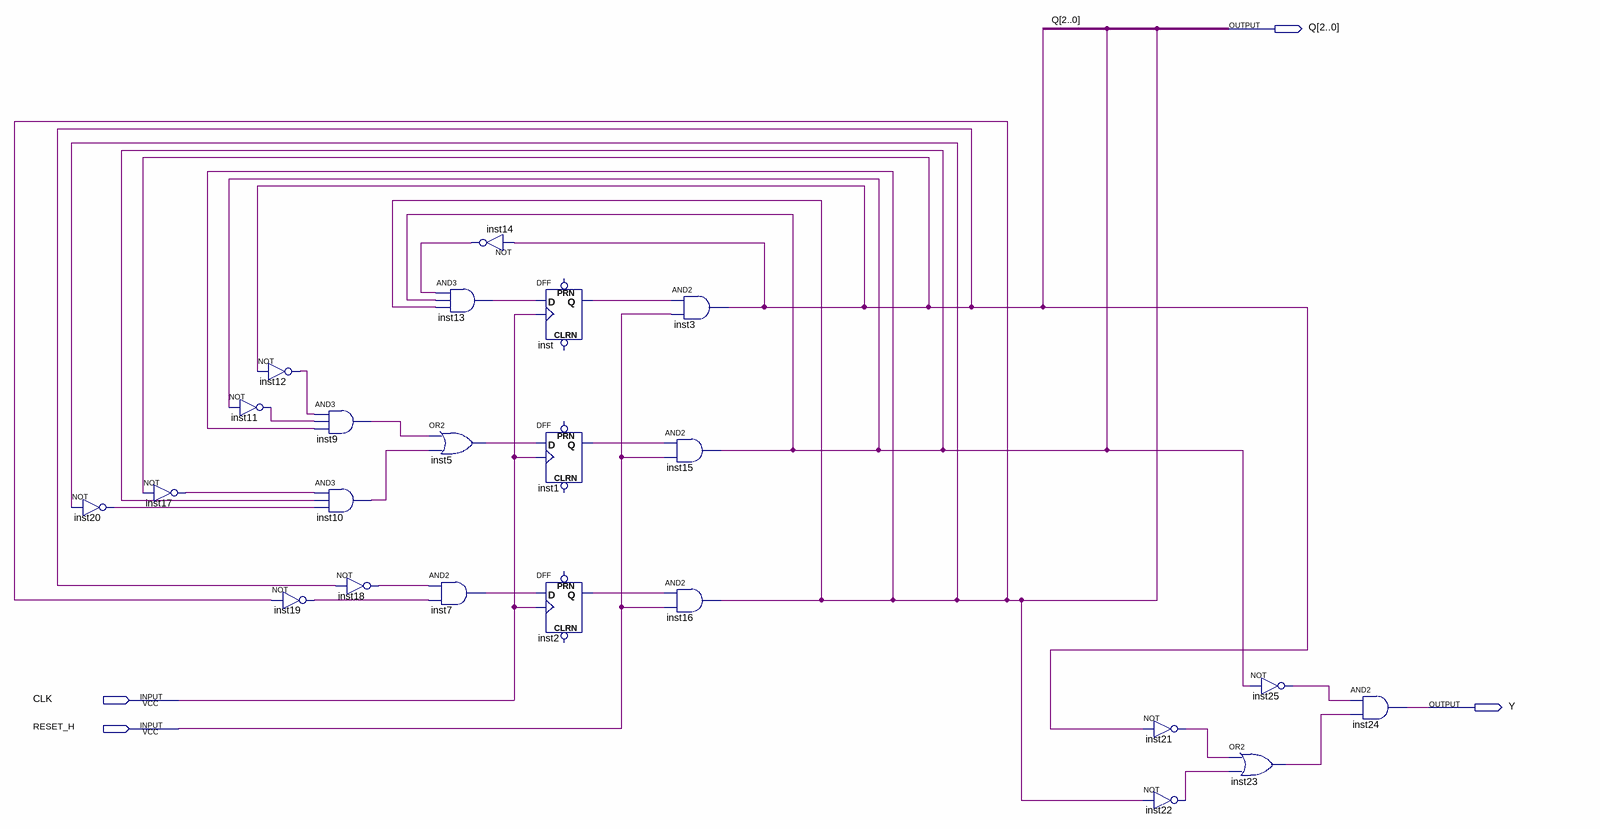
[diagram p0: schematic sheet]
// Quartus schematic MEF.bdf as structural Verilog: 23 symbols, 4 pins
module MEF (
  input  CLK,
  input  RESET_H,
  output [2:0] Q,
  output Y
);

  wire inst1_q, inst2_q, inst3_out, inst5_out, inst7_out, inst9_out, inst10_out, inst11_out, inst12_out,
       inst13_out, inst14_out, inst15_out, inst16_out, inst17_out, inst18_out, inst19_out, inst20_out,
       inst21_out, inst22_out, inst23_out, inst25_out, inst_q;

  not inst20 (inst20_out, inst16_out);
  not inst17 (inst17_out, inst3_out);
  not inst12 (inst12_out, inst3_out);
  not inst11 (inst11_out, inst15_out);
  and inst9 (inst9_out, inst12_out, inst11_out, inst16_out);
  and inst10 (inst10_out, inst17_out, inst15_out, inst20_out);
  not inst19 (inst19_out, inst16_out);
  not inst18 (inst18_out, inst3_out);
  or inst5 (inst5_out, inst9_out, inst10_out);
  and inst7 (inst7_out, inst18_out, inst19_out);
  not inst14 (inst14_out, inst3_out);
  and inst13 (inst13_out, inst14_out, inst15_out, inst16_out);
  DFF inst (.CLK(CLK), .D(inst13_out), .Q(inst_q));  // open: CLRN, PRN
  DFF inst1 (.CLK(CLK), .D(inst5_out), .Q(inst1_q));  // open: CLRN, PRN
  DFF inst2 (.CLK(CLK), .D(inst7_out), .Q(inst2_q));  // open: CLRN, PRN
  and inst3 (inst3_out, inst_q, RESET_H);
  and inst15 (inst15_out, inst1_q, RESET_H);
  and inst16 (inst16_out, inst2_q, RESET_H);
  not inst21 (inst21_out, inst3_out);
  not inst22 (inst22_out, inst16_out);
  or inst23 (inst23_out, inst21_out, inst22_out);
  not inst25 (inst25_out, inst15_out);
  and inst24 (Y, inst25_out, inst23_out);
endmodule
